# Altium schematic sheet usb2jtag.SchDoc
size A3
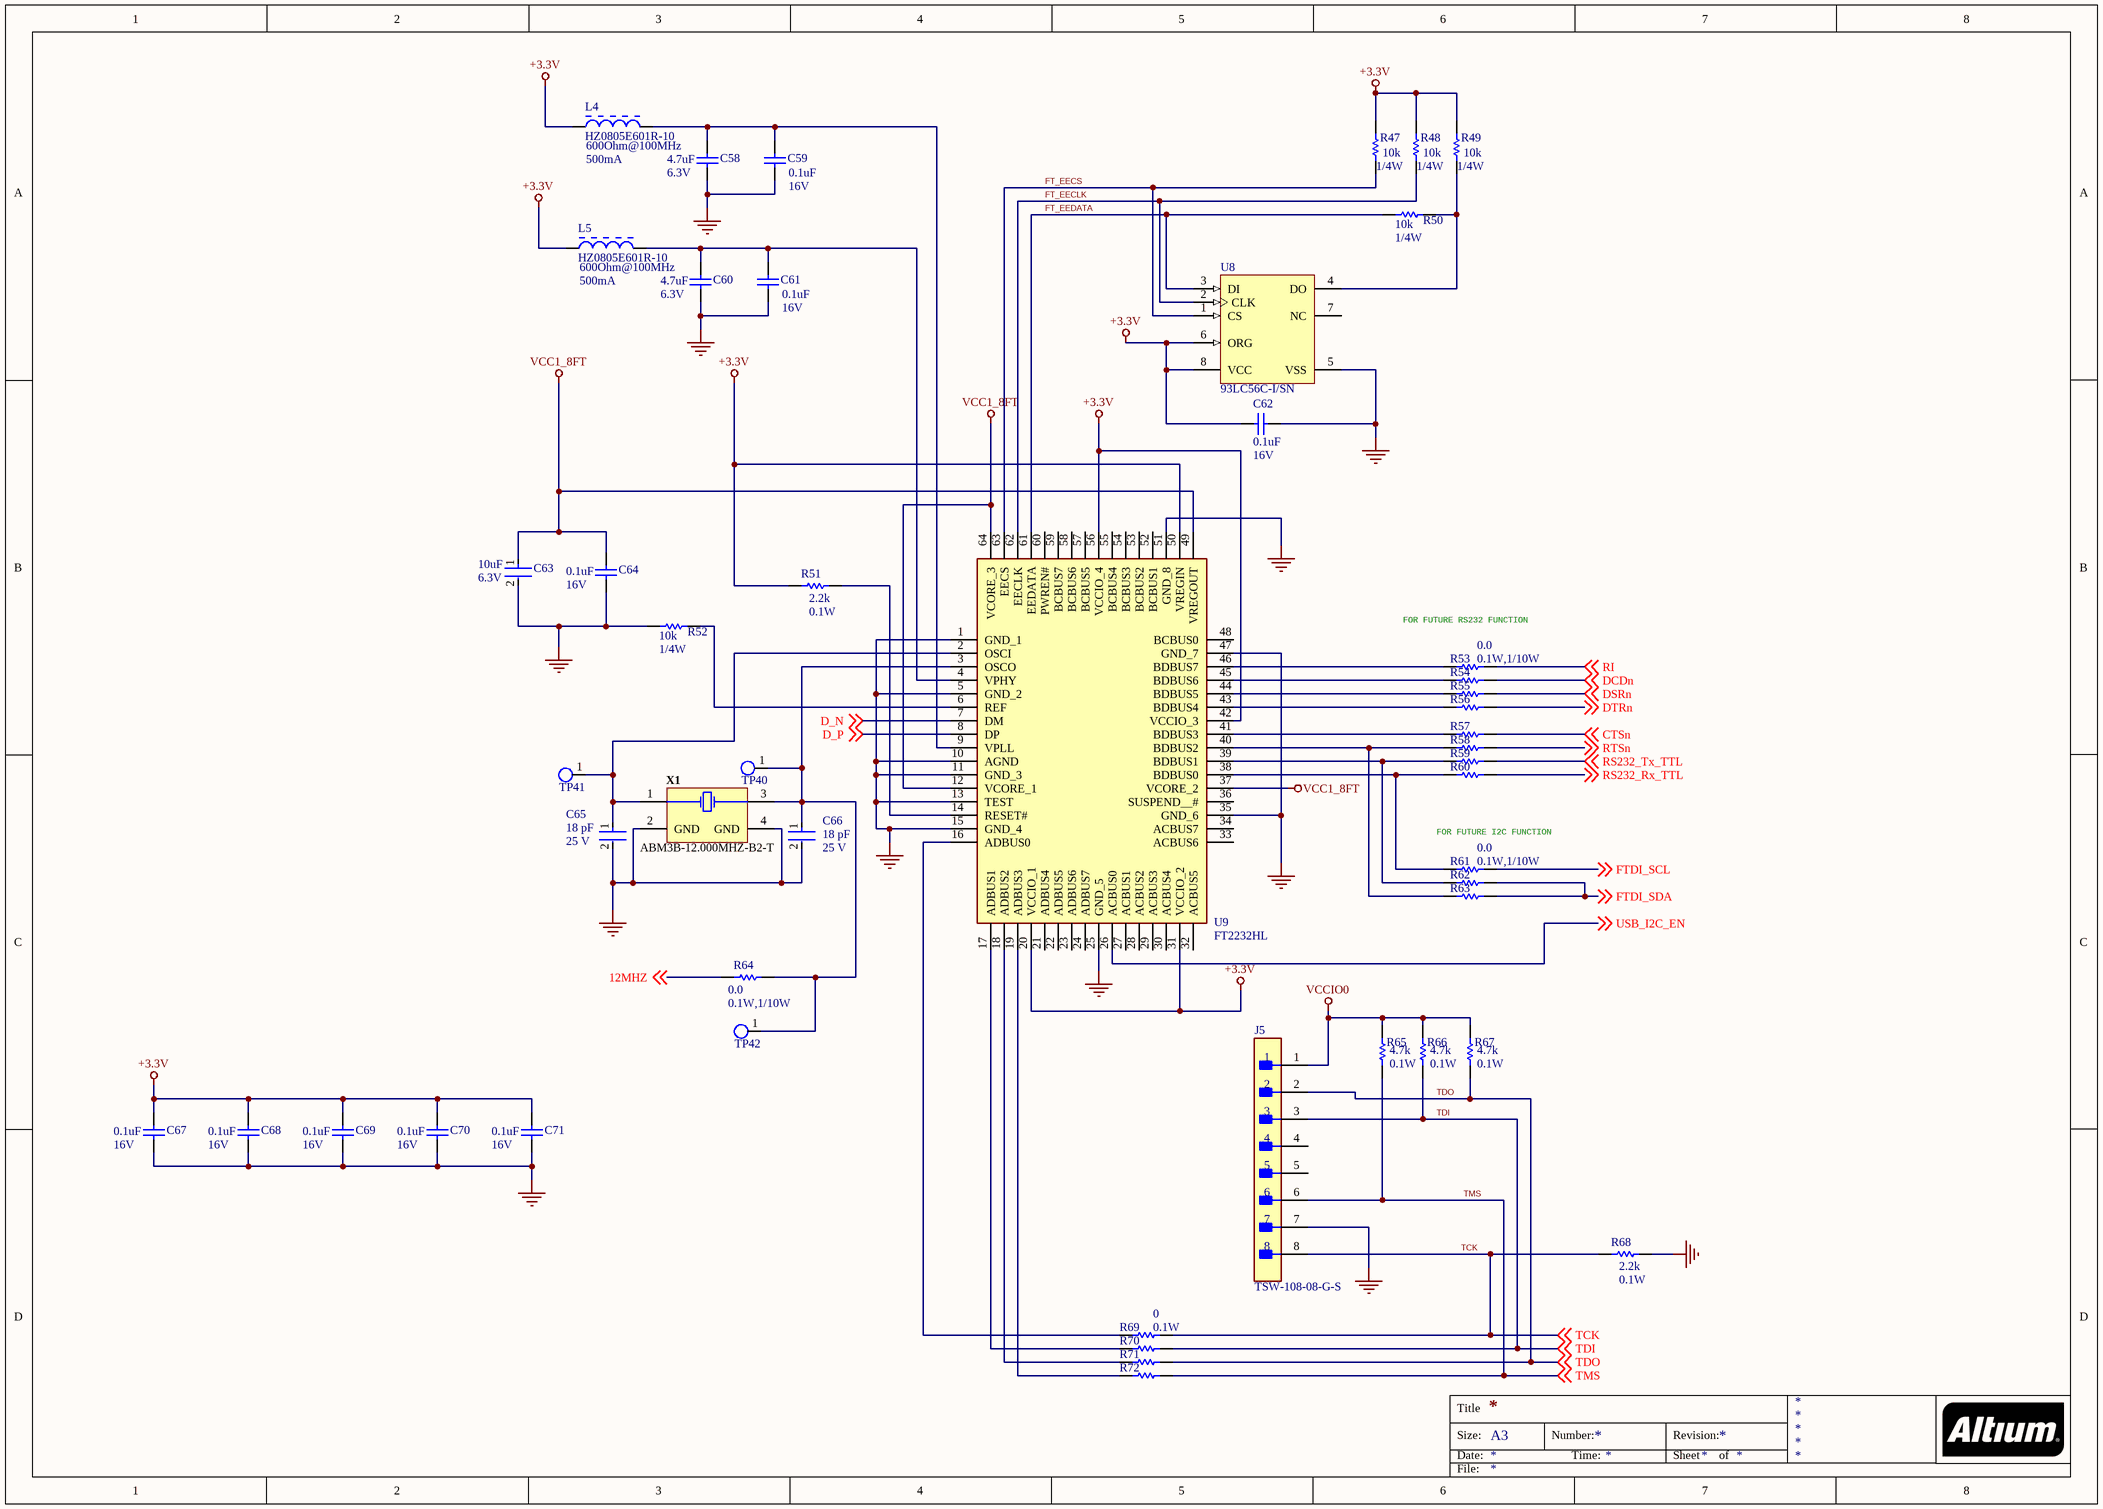
[diagram p0: usb2jtag.SchDoc]

## Parts
C58  value 4.7uF  Voltage: 6.3V  [CAPC2013X145X50NL20T25]  (hidden comment: C0805C475K9PACTU)
C59  value 0.1uF  Voltage: 16V  [CAPC1608X87X35ML15T15]  (hidden comment: C0603C104M4RACTU)
C60  value 4.7uF  Voltage: 6.3V  [CAPC2013X145X50NL20T25]  (hidden comment: C0805C475K9PACTU)
C61  value 0.1uF  Voltage: 16V  [CAPC1608X87X35ML15T15]  (hidden comment: C0603C104M4RACTU)
C62  value 0.1uF  Voltage: 16V  [CAPC1608X87X35ML15T15]  (hidden comment: C0603C104M4RACTU)
C63  value 10uF  Voltage: 6.3V  [FP-CL10-IPC_C]  (hidden comment: CL10A106MQ8NNNC)
C64  value 0.1uF  Voltage: 16V  [CAPC1608X87X35ML15T15]  (hidden comment: C0603C104M4RACTU)
C65  value 18 pF  Voltage: 25 V  [FP-C0603C-CF-MFG]  (hidden comment: C0603C180J3GACAUTO)
C66  value 18 pF  Voltage: 25 V  [FP-C0603C-CF-MFG]  (hidden comment: C0603C180J3GACAUTO)
C67  value 0.1uF  Voltage: 16V  [CAPC1608X87X35ML15T15]  (hidden comment: C0603C104M4RACTU)
C68  value 0.1uF  Voltage: 16V  [CAPC1608X87X35ML15T15]  (hidden comment: C0603C104M4RACTU)
C69  value 0.1uF  Voltage: 16V  [CAPC1608X87X35ML15T15]  (hidden comment: C0603C104M4RACTU)
C70  value 0.1uF  Voltage: 16V  [CAPC1608X87X35ML15T15]  (hidden comment: C0603C104M4RACTU)
C71  value 0.1uF  Voltage: 16V  [CAPC1608X87X35ML15T15]  (hidden comment: C0603C104M4RACTU)
J5  TSW-108-08-G-S  [FP-TSW-108-08-G-S-MFG]
L4  HZ0805E601R-10  Impedance @ Frequency: 600Ohm@100MHz  Current Rating (Max): 500mA  [LIRD-LI0805H151R-10-2_V]
L5  HZ0805E601R-10  Impedance @ Frequency: 600Ohm@100MHz  Current Rating (Max): 500mA  [LIRD-LI0805H151R-10-2_V]
R47  value 10k  Power: 1/4W  [RESC3216X70X50NL05T20]  (hidden comment: ERJ-8GEYJ103V)
R48  value 10k  Power: 1/4W  [RESC3216X70X50NL05T20]  (hidden comment: ERJ-8GEYJ103V)
R49  value 10k  Power: 1/4W  [RESC3216X70X50NL05T20]  (hidden comment: ERJ-8GEYJ103V)
R50  value 10k  Power: 1/4W  [RESC3216X70X50NL05T20]  (hidden comment: ERJ-8GEYJ103V)
R51  value 2.2k  Power: 0.1W  [RESC1608X55X25LL10T15]  (hidden comment: RC0603FR-072K2L)
R52  value 10k  Power: 1/4W  [RESC3216X70X50NL05T20]  (hidden comment: ERJ-8GEYJ103V)
R53  value 0.0  Power: 0.1W,1/10W  [RESC1608X55X35LL10T10]  (hidden comment: RC1608J000CS)
R54  RC1608J000CS  [RESC1608X55X35LL10T10]  (value not drawn)
R55  RC1608J000CS  [RESC1608X55X35LL10T10]  (value not drawn)
R56  RC1608J000CS  [RESC1608X55X35LL10T10]  (value not drawn)
R57  RC1608J000CS  [RESC1608X55X35LL10T10]  (value not drawn)
R58  RC1608J000CS  [RESC1608X55X35LL10T10]  (value not drawn)
R59  RC1608J000CS  [RESC1608X55X35LL10T10]  (value not drawn)
R60  RC1608J000CS  [RESC1608X55X35LL10T10]  (value not drawn)
R61  value 0.0  Power: 0.1W,1/10W  [RESC1608X55X35LL10T10]  (hidden comment: RC1608J000CS)
R62  RC1608J000CS  [RESC1608X55X35LL10T10]  (value not drawn)
R63  RC1608J000CS  [RESC1608X55X35LL10T10]  (value not drawn)
R64  value 0.0  Power: 0.1W,1/10W  [RESC1608X55X35LL10T10]  (hidden comment: RC1608J000CS)
R65  value 4.7k  Power: 0.1W  [RESC1608X55X25LL10T15]  (hidden comment: RC0603FR-074K7L)
R66  value 4.7k  Power: 0.1W  [RESC1608X55X25LL10T15]  (hidden comment: RC0603FR-074K7L)
R67  value 4.7k  Power: 0.1W  [RESC1608X55X25LL10T15]  (hidden comment: RC0603FR-074K7L)
R68  value 2.2k  Power: 0.1W  [RESC1608X55X25LL10T15]  (hidden comment: RC0603FR-072K2L)
R69  value 0  Power: 0.1W  [RESC1609X50X30LL8T20]  (hidden comment: CRCW06034K70FKEA)
R70  CRCW06034K70FKEA  [RESC1609X50X30LL8T20]  (value not drawn)
R71  CRCW06034K70FKEA  [RESC1609X50X30LL8T20]  (value not drawn)
R72  CRCW06034K70FKEA  [RESC1609X50X30LL8T20]  (value not drawn)
TP40  Test_Point_SMD  [Test_Point_SMD]  (value not drawn)
TP41  Test_Point_SMD  [Test_Point_SMD]  (value not drawn)
TP42  Test_Point_SMD  [Test_Point_SMD]  (value not drawn)
U8  93LC56C-I/SN  [SOIC-SN8_L]
U9  FT2232HL  [QFP50P1200X1200X160-64N]
X1  ABM3B-12.000MHZ-B2-T  [ABRA-ABM3B-4_V]

## Nets
+3.3V: C62.2 C67.2 C68.2 C69.2 C70.2 C71.2 L4.1 L5.1 R47.2 R48.2 R49.2 R51.1 U8.6(ORG) U8.8(VCC) U9.20(VCCIO_1) U9.31(VCCIO_2) U9.42(VCCIO_3) U9.50(VREGIN) U9.56(VCCIO_4)
GND: C58.1 C59.1 C60.1 C61.1 C62.1 C63.2 C64.1 C65.2 C66.2 C67.1 C68.1 C69.1 C70.1 C71.1 J5.7 R52.2 R68.2 U8.5(VSS) U9.1(GND_1) U9.5(GND_2) U9.10(AGND) U9.11(GND_3) U9.13(TEST) U9.15(GND_4) U9.25(GND_5) U9.35(GND_6) U9.47(GND_7) U9.51(GND_8) X1.2(GND) X1.4(GND)
VCC1_8FT: C63.1 C64.2 U9.12(VCORE_1) U9.37(VCORE_2) U9.49(VREGOUT) U9.64(VCORE_3)
VCCIO0: J5.1 R65.2 R66.2 R67.2
12MHZ: R64.1 ; off-sheet 12MHZ
CTSn: R57.2 ; off-sheet CTSn
D_N: U9.7(DM) ; off-sheet D_N
D_P: U9.8(DP) ; off-sheet D_P
DCDn: R54.2 ; off-sheet DCDn
DSRn: R55.2 ; off-sheet DSRn
DTRn: R56.2 ; off-sheet DTRn
FT_EECLK: R48.1 U8.2(CLK) U9.62(EECLK)
FT_EECS: R47.1 U8.1(CS) U9.63(EECS)
FT_EEDATA: R50.2 U8.3(DI) U9.61(EEDATA)
FTDI_SCL: R61.2 ; off-sheet FTDI_SCL
FTDI_SDA: R62.2 R63.2 ; off-sheet FTDI_SDA
RI: R53.2 ; off-sheet RI
RS232_Rx_TTL: R60.2 ; off-sheet RS232_Rx_TTL
RS232_Tx_TTL: R59.2 ; off-sheet RS232_Tx_TTL
RTSn: R58.2 ; off-sheet RTSn
TCK: J5.8 R68.1 R69.1 ; off-sheet TCK
TDI: J5.3 R66.1 R70.1 ; off-sheet TDI
TDO: J5.2 R67.1 R71.1 ; off-sheet TDO
TMS: J5.6 R65.1 R72.1 ; off-sheet TMS
USB_I2C_EN: U9.26(ACBUS0) ; off-sheet USB_I2C_EN
NetC58_2: C58.2 C59.2 L4.2 U9.9(VPLL)
NetC60_2: C60.2 C61.2 L5.2 U9.4(VPHY)
NetC65_1: C65.1 TP41.1(TP) U9.2(OSCI) X1.1(X1)
NetC66_1: C66.1 R64.2 TP40.1(TP) TP42.1(TP) U9.3(OSCO) X1.3(X2)
NetR49_1: R49.1 R50.1 U8.4(DO)
NetR51_2: R51.2 U9.14(RESET#)
NetR52_1: R52.1 U9.6(REF)
NetR53_1: R53.1 U9.46(BDBUS7)
NetR54_1: R54.1 U9.45(BDBUS6)
NetR55_1: R55.1 U9.44(BDBUS5)
NetR56_1: R56.1 U9.43(BDBUS4)
NetR57_1: R57.1 U9.41(BDBUS3)
NetR58_1: R58.1 R63.1 U9.40(BDBUS2)
NetR59_1: R59.1 R62.1 U9.39(BDBUS1)
NetR60_1: R60.1 R61.1 U9.38(BDBUS0)
NetR69_2: R69.2 U9.16(ADBUS0)
NetR70_2: R70.2 U9.17(ADBUS1)
NetR71_2: R71.2 U9.18(ADBUS2)
NetR72_2: R72.2 U9.19(ADBUS3)

Not connected (* = marked no-connect by the designer): J5 4 5; U8 7(NC); U9 21(ADBUS4) 22(ADBUS5) 23(ADBUS6) 24(ADBUS7) 27(ACBUS1) 28(ACBUS2) 29(ACBUS3) 30(ACBUS4) 32(ACBUS5) 33(ACBUS6) 34(ACBUS7) 36(SUSPEND__#) 48(BCBUS0) 52(BCBUS1) 53(BCBUS2) 54(BCBUS3) 55(BCBUS4) 57(BCBUS5) 58(BCBUS6) 59(BCBUS7) 60(PWREN#)

## Notes on the sheet
- FOR FUTURE RS232 FUNCTION
- FOR FUTURE I2C FUNCTION
- Title
- Size:
- Date:
- A3
- Number:
- Time:
- Revision:
- Sheet
- of
- File:

## Library data of the parts
C58 C60 = CMP-2007-01009-1: Manufacturer: Kemet; Alternative1: GRM219R61A475KE34D Murata; Alternative2: C0805C475K3PACTU KEMET; Alternative3: CC0805KKX5R7BB475 Yageo; Part Number: C0805C475K9PACTU; Package / Case: 0805
C59 C61 C62 C64 C67-C71 = CMP-2006-03067-1: Ceramic Capacitor 0.1uF 16V +-10% X7R0603; Manufacturer: Kemet; Alternative1: C1608X7R1E104K TDK; Alternative2: CC0603KRX7R8BB104 Yageo; Alternative3: GRM188R72A104KA35D Murata; Part Number: C0603C104M4RACTU; Package / Case: 0603
C63 = CMP-13271-001938-1: Cap Ceramic 10uF 6.3V X5R ±20% Pad SMD 0603 +85°C T/R; Manufacturer: Samsung; Alternative1: LMK107BJ106MALTD Taiyo Yuden; Alternative2: C1608X5R0J106K080AB TDK; Alternative3: 06036D106MAT2A Kyocera AVX; Height: 0.8mm; Width: 0.031inch; Min Operating Temperature: -55°C; Dielectric: X5R; Package / Case: 0603; Radiation Hardening: No; Packaging: Tape and Reel; Max Operating Temperature: 85°C; Thickness: 0.035inch; Mount: Surface Mount; Case Code (Imperial): 0603; Case Code (Metric): 1608; Depth: 0.8mm; Tolerance: 20%; Length: 1.6mm; Part Number: CL10A106MQ8NNNC
C65 C66 = CMP-03020-020748-1: CAP CER 18PF 25V C0G/NP0 0603; Manufacturer: KEMET; Tolerance: 0.05; Temperature Characteristic: C0G; Material: Ceramic; Temperature Coefficient: 30ppm/°C; Automotive: Yes; Package / Case: C0603C-CF; Device Class L2: Capacitors; Part Number: C0603C180J3GACAUTO; ComponentLink2Description: Datasheet; Device Class L3: Ceramic Capacitors; Temperature Range Low: -55°C; Temperature Range High: +125°C; Lead Free: Yes; Digikey Description: CAP CER 18PF 25V C0G/NP0 0603; Temperature: -55°C to +125°C; Octopart: https://octopart.com/c0603c180j3gacauto-kemet-21982873; Height: 0.87mm; Capacitance: 18 pF; RoHS: TRUE; ComponentLink2URL: https://api.kemet.com/component-edge/download/datasheet/C0603C100J5GACAUTO.pdf
J5 = CMP-02766-000001-1: CONN HEADER VERT 8POS 2.54MM; Manufacturer: Samtec; Number Of Contacts: 8; Conn Orientation: Straight; Conn Gender: Male; Device Class L1: Connectors; ComponentLink2Description: Datasheet; Digikey Description: CONN HEADER VERT 8POS 2.54MM; ComponentLink2URL: http://suddendocs.samtec.com/catalog_english/tsw_th.pdf; Temperature: -55°C to +125°C; RoHS: TRUE; Mouser Description: TSW - Samtec 2.54mm Pin Header 13.46mm Overall Pin Length 5.08mm Tail; Automotive: No; Temperature Range High: +125°C; Package: TSW-108-08-G-S; Device Class L3: unset; Manufacturer Part Number: TSW-108-08-G-S; Pitch: 2.54mm; Number Of Rows: 1; Lead Free: Yes; Height: 8.71mm; Contact Material: Gold,Nickel; Footprint Url: http://suddendocs.samtec.com/prints/tsw-xxx-xx-x-x-xx-xxx-footprint.pdf; Temperature Range Low: -55°C; Octopart: https://octopart.com/tsw-108-08-g-s-samtec-272653; Category: Conn; Device Class L2: Headers and Wire Housings
L4 = CMP-2000-05194-1: Chip Bead for Signal Filtering, 600 Ohm, 500 mA, -40 to 125 degC, 0805 (2012 Metric), RoHS, Tape and Reel; Manufacturer: Laird; Other Names: 240-2399-1; DC Resistance (DCR) (Max): 300mOhm; Operating Temperature: -40degC~125degC; Datasheet URL: https://datasheet.ciiva.com/22622/1685710-22622833.pdf; Mounting Type: SurfaceMount; Package / Case: 0805(2012Metric); Package Description: 2-Pin Surface Mount Device, Body 2 x 1.25 mm; Package Reference: LI0805H15R-10-2; Size / Dimension: 0.079"Lx0.049"W(2.00mmx1.25mm); Height (Max): 0.043"(1.10mm); Part Number: HZ0805E601R-10
L5 = CMP-2000-05194-1: Chip Bead for Signal Filtering, 600 Ohm, 500 mA, -40 to 125 degC, 0805 (2012 Metric), RoHS, Tape and Reel; Manufacturer: Laird; Other Names: 240-2399-1; Kits: 240-2227-ND-KITEMIFERRITEBEADCHIPSMD; DC Resistance (DCR) (Max): 300mOhm; Filter Type: SignalLine; Operating Temperature: -40degC~125degC; Datasheet URL: https://datasheet.ciiva.com/22622/1685710-22622833.pdf; Mounting Type: SurfaceMount; Package / Case: 0805(2012Metric); Package Description: 2-Pin Surface Mount Device, Body 2 x 1.25 mm; Package Reference: LI0805H15R-10-2; Size / Dimension: 0.079"Lx0.049"W(2.00mmx1.25mm); Height (Max): 0.043"(1.10mm); Part Number: HZ0805E601R-10
R47-R50 R52 = CMP-2003-00545-1: Res Thick Film 1206 10k Ohms 5% 1/4W; Manufacturer: Panasonic; Alternative1: CR1206F-10KFI TT Welwyn; Alternative2: WR12X1002FGL Walsin Technologies; Alternative3: CR1206-FX-1002ELF Bourns; Part Number: ERJ-8GEYJ103V; Package / Case: 1206
R51 R68 = CMP-2000-06934-1: Thick Film Resistor, 2.2 KOhm, 100 mW, 50 V, +/- 1%, -55 to 155 degC, 2-Pin SMD (0603), RoHS, Tape and Reel; Manufacturer: Yageo; Temperature Coefficient: 100PPM/C; Voltage: 50V; Alternative1: RC0603FR-102K2L Yageo; Alternative2: RMCF0603FT2K20 Stackpole Electronics; Alternative3: CRCW06032K20FKEA Vishay; Tolerance: 1%; Datasheet Version: Rev. 7, 05/2017; Case Code - mm: 1608; Series: RC; Mounting Technology: SurfaceMount; Package Description: 2-Pin Surface Mount Device, Body 1.6 x 0.8 mm; Package / Case: 0603; Package Reference: 0603; Product: ThickFilmResistorsGeneralPurpose; Manufacturer URL: http://www.yageo.com/; Termination Style: SMD/SMT; Operating Temperature Range: -55Cto+155C; Datasheet URL: http://www.yageo.com/documents/recent/PYu-RC_Group_51_RoHS_L_7.pdf; Packaging: Reel
R53 R61 R64 = CMP-2000-06972-1: Chip Resistor, 0 Ohm, +/- 5%, 0.1 W, -55 to 155 degC, 0603 (1608 Metric), RoHS, Tape and Reel; Manufacturer: Samsung-Electro-Mechanics-America,-Inc.; Tolerance: Jumper; Alternative1: RC0603JR-130RL Yageo; Alternative2: RC0603JR-100RL Yageo; Alternative3: CRCW0603-0000Z0EA Vishay; Manufacturer URL: http://www.samsungsem.com/global/index.jsp; Features: MoistureResistant; Mounting Technology: SurfaceMount; Series: RC; Package / Case: 0603(1608Metric); Category: Resistors; Operating Temperature: -55°C~155°C; Datasheet URL: http://static6.arrow.com/aropdfconversion/3cece72dd289ffbadc164fbcd05f638dd7240f7b/rc_datasheet_150330.pdf.pdf?authToken=eyJ0eXAiOiJKV1QiLCJhbGciOiJIUzI1NiJ9.eyJTZXNzaW9uSWQiOiJtY3ZlYXdxYmptZXdpdXdyeG1ha2FxdWciLCJEb3dubG9hZFR5cGUiOiJEYXRhc2hlZXRzIiwiaXNzIjoic2VsZiIsImF1ZCI6Imh0dHA6Ly9kYXRhc2hlZXRhdXRoLmFycm93LmNvbSIsImV4cCI6MTQ3Njg1OTQ5NiwibmJmIjoxNDc2ODU5Mzc2fQ.1rZWSrRNyHkP6J5YmszFzS2kzmlbN9BKNvWJ4ACiP-Q; Datasheet Version: 09/2015; Composition: ThickFilm; Package Description: 2-Pin Chip Resistor, Body 1.6 x 0.8 mm; Height: 0.022"(0.55mm); Family: ChipResistor-SurfaceMount; Temperature Coefficient: -; Size / Dimension: 0.063"Lx0.031"W(1.60mmx0.80mm); Part Number: RC1608J000CS
R54-R60 R62 R63 = CMP-2000-06972-1: Chip Resistor, 0 Ohm, +/- 5%, 0.1 W, -55 to 155 degC, 0603 (1608 Metric), RoHS, Tape and Reel; Manufacturer: Samsung-Electro-Mechanics-America,-Inc.; Power: 0.1W,1/10W; Value: 0.0; Tolerance: Jumper; Alternative1: RC0603JR-130RL Yageo; Alternative2: RC0603JR-100RL Yageo; Alternative3: CRCW0603-0000Z0EA Vishay; Manufacturer URL: http://www.samsungsem.com/global/index.jsp; Features: MoistureResistant; Mounting Technology: SurfaceMount; Series: RC; Package / Case: 0603(1608Metric); Category: Resistors; Operating Temperature: -55°C~155°C; Datasheet URL: http://static6.arrow.com/aropdfconversion/3cece72dd289ffbadc164fbcd05f638dd7240f7b/rc_datasheet_150330.pdf.pdf?authToken=eyJ0eXAiOiJKV1QiLCJhbGciOiJIUzI1NiJ9.eyJTZXNzaW9uSWQiOiJtY3ZlYXdxYmptZXdpdXdyeG1ha2FxdWciLCJEb3dubG9hZFR5cGUiOiJEYXRhc2hlZXRzIiwiaXNzIjoic2VsZiIsImF1ZCI6Imh0dHA6Ly9kYXRhc2hlZXRhdXRoLmFycm93LmNvbSIsImV4cCI6MTQ3Njg1OTQ5NiwibmJmIjoxNDc2ODU5Mzc2fQ.1rZWSrRNyHkP6J5YmszFzS2kzmlbN9BKNvWJ4ACiP-Q; Datasheet Version: 09/2015; Composition: ThickFilm; Package Description: 2-Pin Chip Resistor, Body 1.6 x 0.8 mm; Height: 0.022"(0.55mm); Family: ChipResistor-SurfaceMount; Temperature Coefficient: -; Size / Dimension: 0.063"Lx0.031"W(1.60mmx0.80mm); Part Number: RC1608J000CS
R65-R67 = CMP-2000-06942-1: Chip Resistor, 4.7 KOhm, +/- 1%, 0.1 W, -55 to 155 degC, 0603 (1608 Metric), RoHS, Tape and Reel; Manufacturer: Yageo; Temperature Coefficient: 100PPM/C; Voltage Rating: 50V; Package / Case: 0603; Series: RC; Datasheet URL: http://www.yageo.com/documents/recent/PYu-RC_Group_51_RoHS_L_7.pdf; Case Code - mm: 1608; Operating Temperature Range: -55Cto+155C; Tolerance: 1%
R69 = CMP-1666-00019-2: Chip Resistor, 4.7 KOhm, +/- 1%, 100 mW, -55 to 155 degC, 0603 (1608 Metric), RoHS, Tape and Reel; Manufacturer: Vishay; Alternative 1: RC0603FR-134K7L Yageo; Alternative 2: WR06X4701FGL Walsin Technologies; Alternative 3: CRCW06031R50FNEA Vishay Dale; ComponentLink1Description: Manufacturer URL; RoHSCompliant: true; ComponentLink2URL: http://www.vishay.com/docs/20035/dcrcwe3.pdf; Package / Case: 0603; ComponentLink2Description: Datasheet; ComponentLink1URL: http://www.vishay.com/; Part Number: CRCW06034K70FKEA
R70-R72 = CMP-1666-00019-2: Chip Resistor, 4.7 KOhm, +/- 1%, 100 mW, -55 to 155 degC, 0603 (1608 Metric), RoHS, Tape and Reel; Manufacturer: Vishay; Alternative 1: RC0603FR-134K7L Yageo; Alternative 2: WR06X4701FGL Walsin Technologies; Alternative 3: CRCW06031R50FNEA Vishay Dale; Value: 0; Power: 0.1W; ComponentLink1Description: Manufacturer URL; RoHSCompliant: true; ComponentLink2URL: http://www.vishay.com/docs/20035/dcrcwe3.pdf; Package / Case: 0603; ComponentLink2Description: Datasheet; ComponentLink1URL: http://www.vishay.com/; Part Number: CRCW06034K70FKEA
U8 = CMP-0162-00111-1: 2K, 256x8 or 128x16-bit, 2.5V Microwire Serial EEPROM, 8-Pin SOIC 150mil, Industrial Temperature; ComponentAvailability: Unknown. Contact manufacturer to determine status.; PackageReference: SOIC-SN8; PackageVersion: revBB, Aug-2009; Code_IPC: SOIC127P600-8; PackageDescription: 8-Lead Plastic Small Outline (SN) - Narrow, 3.90mm Body [SOIC]; DatasheetVersion: revF, May-2008; Code_JEDEC: MS-012
U9 = FT2232HL-REEL: Integrated Circuit; Manufacturer: FTDI Chip; Datasheet Link: http://www.ftdichip.com/Support/Documents/DataSheets/ICs/DS_FT2232H.pdf; Height: 1.6mm; Part Number: FT2232HL; Arrow Part Number: FT2232HL-REEL; Arrow Price/Stock: https://www.arrow.com/en/products/ft2232hl-reel/ftdi-chip; Mouser Part Number: 895-FT2232HL; Mouser Price/Stock: https://www.mouser.co.uk/ProductDetail/FTDI/FT2232HL-REEL?qs=D1%2FPMqvA100v7FHcEx164g%3D%3D; Package / Case: QFP50
X1 = CMP-1688-00007-1: Ceramic SMD Crystal, 12 MHz, +/- 20 ppm, 70 Ohm, -20 to 70 degC, 4-Pin SMD, RoHS, Tape and Reel; Manufacturer: Abracon; Max Input Voltage: 25 V; Dropout Voltage: 2 V; Max Ouput Current: 1.5 A; Nominal Output Voltage: 5 V; Min Input Voltage: 7 V; Package / Case: TO-263-4; Mount: Surface Mount; ComponentLink2Description: Datasheet; DatasheetVersion: Aug-15; PackageReference: ABM3B; Radiation Hardening: No; Weight: 0.050897 oz; ComponentLink1URL: http://www.abracon.com/; RoHSCompliant: true; Max Operating Temperature: 125 degC; PackageDescription: 4-Pin Surface Mount Device, Body 5 x 3.2 mm; ComponentLink1Description: Manufacturer URL; Package Quantity: 500; Output Voltage: 5 V; ComponentLink2URL: http://www.abracon.com/Resonators/abm3b.pdf; Min Operating Temperature: 0 degC; Output Current: 1.5 A; Packaging: Tape and Reel; Pins: 3; REACH SVHC: No SVHC; Part Number: ABM3B-12.000MHZ-B2-T